# Altium project Buchla Bus Board PSU.PrjPcb
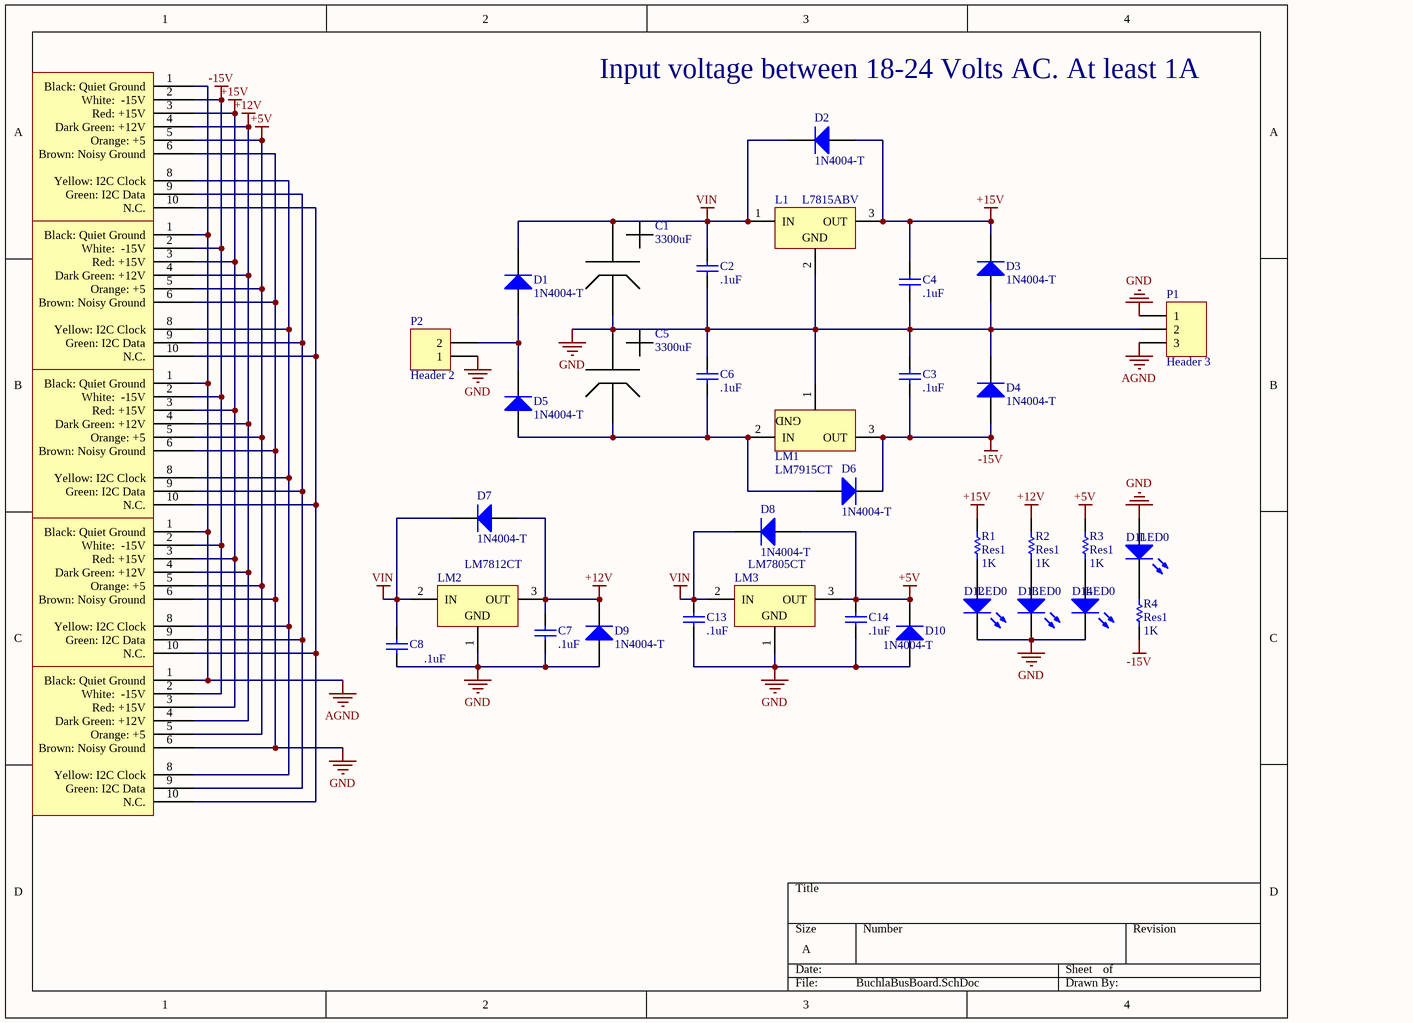
[diagram p0: BuchlaBusBoard.SchDoc]
1 sheet, 39 parts. Net scope: global (net labels, ports and power ports of the same name join across sheets).
Board file: Buchla6PosDist.PcbDoc

## Sheet BuchlaBusBoard.SchDoc
size A

### Parts
C1  3300uF  [100uF]
C2  .1uF  [.1uF]
C3  .1uF  [.1uF]
C4  .1uF  [.1uF]
C5  3300uF  [100uF]
C6  .1uF  [.1uF]
C7  .1uF  [.1uF]
C8  .1uF  [.1uF]
C13  .1uF  [.1uF]
C14  .1uF  [.1uF]
D1  1N4004-T  [DIOD-DO-41-P-2_V]
D2  1N4004-T  [DIOD-DO-41-P-2_V]
D3  1N4004-T  [DIOD-DO-41-P-2_V]
D4  1N4004-T  [DIOD-DO-41-P-2_V]
D5  1N4004-T  [DIOD-DO-41-P-2_V]
D6  1N4004-T  [DIOD-DO-41-P-2_V]
D7  1N4004-T  [DIOD-DO-41-P-2_V]
D8  1N4004-T  [DIOD-DO-41-P-2_V]
D9  1N4004-T  [DIOD-DO-41-P-2_V]
D10  1N4004-T  [DIOD-DO-41-P-2_V]
D11  LED0  [LED-0]
D12  LED0  [LED-0]
D13  LED0  [LED-0]
D14  LED0  [LED-0]
L1  L7815ABV  [TO220]
LM1  LM7915CT  [NDE0003A]
LM2  LM7812CT  [NDE0003A]
LM3  LM7805CT  [NDE0003A]
P1  Header 3  [HDR1X3]
P2  Header 2  [HDR1X2]
R1  Res1  value 1K  [AXIAL-0.3]
R2  Res1  value 1K  [AXIAL-0.3]
R3  Res1  value 1K  [AXIAL-0.3]
R4  Res1  value 1K  [AXIAL-0.3]
Vag1  Component_1  [BuchlaPower]  (value not drawn)
Vag2  Component_1  [BuchlaPower]  (value not drawn)
Vag5  Component_1  [BuchlaPower]  (value not drawn)
Vag6  Component_1  [BuchlaPower]  (value not drawn)
Vag7  Component_1  [BuchlaPower]  (value not drawn)

### Nets
+5V: C14.2 D8.1(A) D10.2(K) LM3.3(OUT) R3.2 Vag1.5(Orange:_+5) Vag2.5(Orange:_+5) Vag5.5(Orange:_+5) Vag6.5(Orange:_+5) Vag7.5(Orange:_+5)
+12V: C7.2 D7.1(A) D9.2(K) LM2.3(OUT) R2.2 Vag1.4(Dark_Green:_+12V) Vag2.4(Dark_Green:_+12V) Vag5.4(Dark_Green:_+12V) Vag6.4(Dark_Green:_+12V) Vag7.4(Dark_Green:_+12V)
+15V: C4.2 D2.1(A) D3.2(K) L1.3(OUT) R1.2 Vag1.3(Red:_+15V) Vag2.3(Red:_+15V) Vag5.3(Red:_+15V) Vag6.3(Red:_+15V) Vag7.3(Red:_+15V)
-15V: C3.1 D4.1(A) D6.2(K) LM1.3(OUT) R4.1 Vag1.2(White:__-15V) Vag2.2(White:__-15V) Vag5.2(White:__-15V) Vag6.2(White:__-15V) Vag7.2(White:__-15V)
AGND: P1.3 Vag1.1(Black:_Quiet_Ground) Vag2.1(Black:_Quiet_Ground) Vag5.1(Black:_Quiet_Ground) Vag6.1(Black:_Quiet_Ground) Vag7.1(Black:_Quiet_Ground)
GND: C1.1 C2.1 C3.2 C4.1 C5.0 C6.2 C7.1 C8.1 C13.1 C14.1 D3.1(A) D4.2(K) D9.1(A) D10.1(A) D11.1(A) D12.2(K) D13.2(K) D14.2(K) L1.2(GND) LM1.1(GND) LM2.1(GND) LM3.1(GND) P1.1 P1.2 P2.1 Vag1.6(Brown:_Noisy_Ground) Vag2.6(Brown:_Noisy_Ground) Vag5.6(Brown:_Noisy_Ground) Vag6.6(Brown:_Noisy_Ground) Vag7.6(Brown:_Noisy_Ground)
VIN: C1.0 C2.2 C8.2 C13.2 D1.2(K) D2.2(K) D7.2(K) D8.2(K) L1.1(IN) LM2.2(IN) LM3.2(IN)
NetC5_1: C5.1 C6.1 D5.1(A) D6.1(A) LM1.2(IN)
NetD1_1: D1.1(A) D5.2(K) P2.2
NetD11_2: D11.2(K) R4.2
NetD12_1: D12.1(A) R1.1
NetD13_1: D13.1(A) R2.1
NetD14_1: D14.1(A) R3.1
NetVag1_8: Vag1.8(Yellow:_I2C_Clock) Vag2.8(Yellow:_I2C_Clock) Vag5.8(Yellow:_I2C_Clock) Vag6.8(Yellow:_I2C_Clock) Vag7.8(Yellow:_I2C_Clock)
NetVag1_9: Vag1.9(Green:_I2C_Data) Vag2.9(Green:_I2C_Data) Vag5.9(Green:_I2C_Data) Vag6.9(Green:_I2C_Data) Vag7.9(Green:_I2C_Data)
NetVag1_10: Vag1.10(N.C.) Vag2.10(N.C.) Vag5.10(N.C.) Vag6.10(N.C.) Vag7.10(N.C.)

### Notes on the sheet
- Input voltage between 18-24 Volts AC. At least 1A

### Library data of the parts
C1 C5 = 100uF Sprague: 100uF Electrolytic; Mfr: Illinois; Mfr_Pn: 107TTA050M; Distributor: Mouser; Distributor_Pn: 598-107TTA050M
C2-C4 C6-C8 C13 C14 = Cap: .1uF Cap; Mfr: Vishay; Mfr_Pn: BFC237178104; Published: 8-Jun-2000; LatestRevisionDate: 17-Jul-2002; LatestRevisionNote: Re-released for DXP Platform.; PackageReference: RAD-0.3; Publisher: Altium Limited; PackageDescription: Radial Cap, Thru-Hole; 2 Leads; 0.3 in Pin Spacing; Value: .1uF; Distributor: Mouser; Distributor_Pn: 594-2222-371-78104
D1-D10 = CMP-0639-00006-2: 1.0 A Rectifier, 15 pF, 50 V, -65 to 150 degC, 2-Pin DO-41 Plastic, RoHS, Tape and Reel; Mfr_Pn: 1N4001-T; Mfr: Diodes Inc; VF (V): 1; CT (pF): 15; Max. IR (uA): 5; VRRM (V): 50; Max. IFSM (A): 30; RoHS: TRUE; Mounting Technology: Through Hole; ComponentLink2Description: Datasheet; DatasheetVersion: Rev. 8-2; Operating Temperature Range (degC): -65 to 150; Packing: Tape and Reel; PackageReference: DO-41-P-2; ComponentLink1URL: http://diodes.com/; PackageDescription: 2-Pin Axial Lead, Body 4.635 x 2.36 mm, Lead Spread 25.4 mm; ComponentLink2URL: http://diodes.com/datasheets/ds28002.pdf; Max. Average Rectified Current IO (A): 1; ComponentLink1Description: Manufacturer URL; Distributor: Mouser; Distributor_Pn: 621-1N4001
D11-D14 = LED0: Typical INFRARED GaAs LED; Published: 8-Jun-2000; LatestRevisionDate: 08-Jul-2005; LatestRevisionNote: Mech Layer 1 removed.; PackageReference: LED-0; Publisher: Altium Limited; PackageDescription: LED; 2 Leads
L1 = CMP-0244-00468-1: 15V Positive Regulator; Mfr: ST; ComponentLink1URL: http://www.st.com; ComponentLink3Description: Package Specification; ComponentLink3URL: http://www.st.com/internet/com/TECHNICAL_RESOURCES/TECHNICAL_LITERATURE/PACKAGE_INFORMATION/CD00004649.pdf; DatasheetVersion: 16/11/2011; ComponentLink2URL: http://www.st.com/internet/com/TECHNICAL_RESOURCES/TECHNICAL_LITERATURE/DATASHEET/CD00000444.pdf; PackageDescription: TO, Thru-Hole, Vertical, Heatsink Mounted; 3 In-Line Leads; Pitch 2.54 mm; ComponentLink1Description: Manufacturer URL; PackageVersion: ver3.0; ComponentLink2Description: Datasheet; PackageReference: TO220; Mfr_Pn: L7815ABV; Distributor: Mouser; Distributor_Pn: 511-L7815ABV
LM1 = CMP-0062-02471-3: 3-Terminal Negative Regulator, 3-pin TO-220; Manufacturer: Texas Instruments; PackageTopMarking: NSUZXYTTE#*LM7915CT; CompType: LDO IC; PowerWise: N; ComponentLink1Description: Datasheet URL; PinCount: 3; PackageDescription: TO-220, Molded, 3 Lead, Straight; RoHS: N; PackageReference: NDE0003A; ComponentLink1URL: http://www.ti.com/general/docs/lit/getliterature.tsp?genericPartNumber=LM7915&fileType=pdf
LM2 LM3 = CMP-0062-02471-3: 3-Terminal Negative Regulator, 3-pin TO-220; pin to pad: 1>2 2>1; Manufacturer: Texas Instruments; PackageTopMarking: NSUZXYTTE#*LM7915CT; CompType: LDO IC; PowerWise: N; ComponentLink1Description: Datasheet URL; PinCount: 3; PackageDescription: TO-220, Molded, 3 Lead, Straight; RoHS: N; PackageReference: NDE0003A; ComponentLink1URL: http://www.ti.com/general/docs/lit/getliterature.tsp?genericPartNumber=LM7915&fileType=pdf
P1 = Header 3: Header, 3-Pin; LatestRevisionDate: 17-Jul-2002; LatestRevisionNote: Re-released for DXP Platform.; Publisher: Altium Limited
P2 = Header 2: Header, 2-Pin; LatestRevisionDate: 17-Jul-2002; LatestRevisionNote: Re-released for DXP Platform.; Publisher: Altium Limited
R1-R4 = Res1: Resistor; Published: 8-Jun-2000; LatestRevisionDate: 17-Jul-2002; LatestRevisionNote: Re-released for DXP Platform.; PackageReference: AXIAL-0.3; Publisher: Altium Limited; PackageDescription: Axial Device, Thru-Hole; 2 Leads; 0.3 in Pin Spacing